# EAGLE schematic motherboard (EAGLE 6.1)
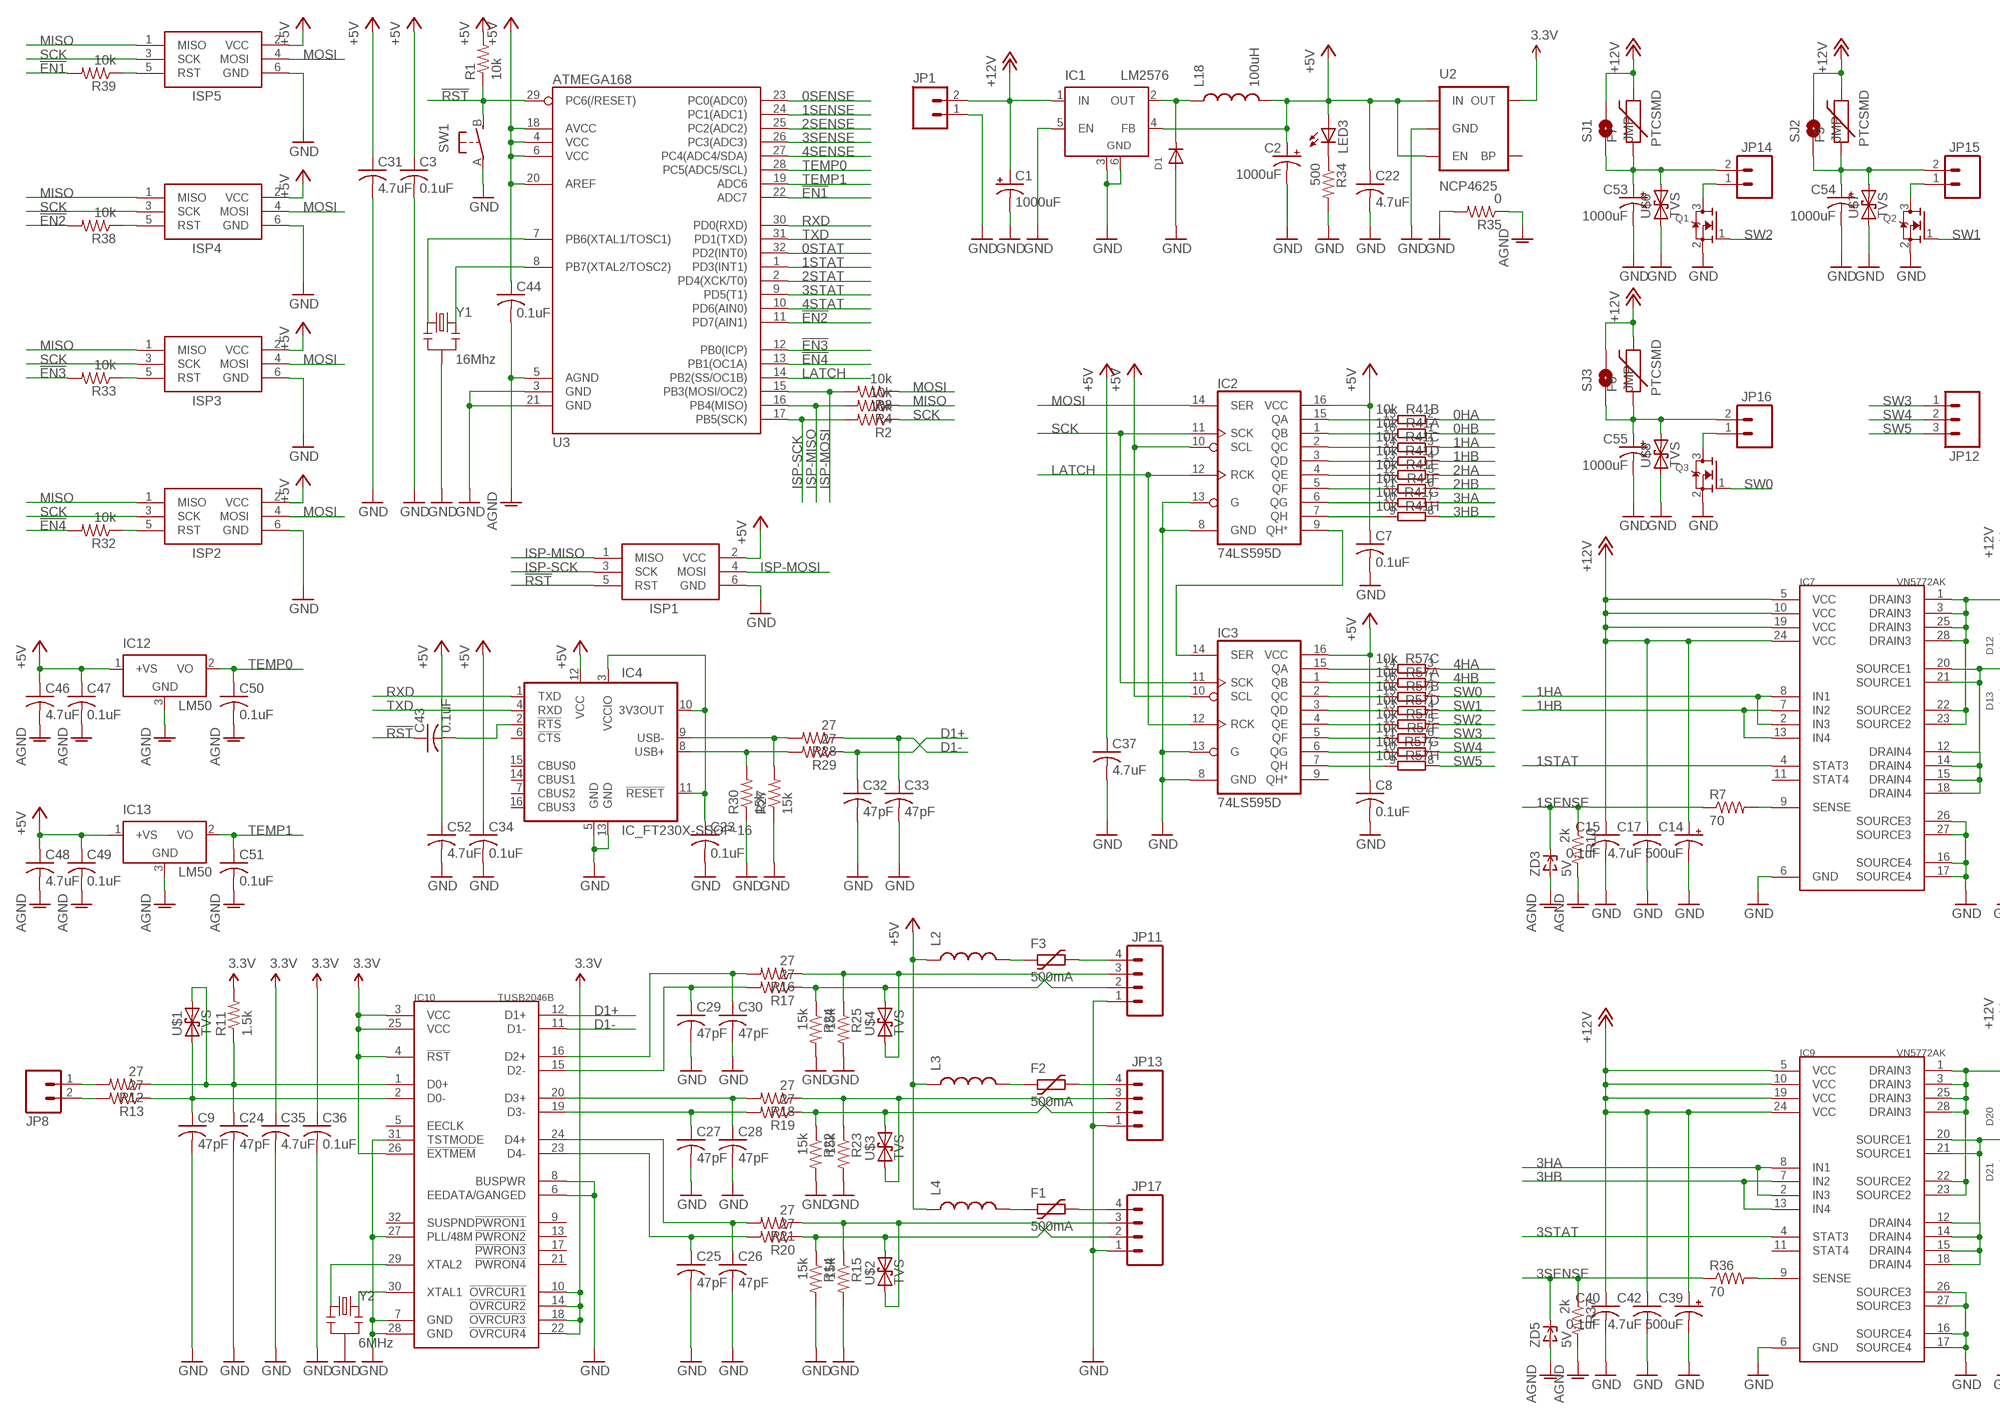
[diagram p0: schematic, sheet 1, part 1 of 2]
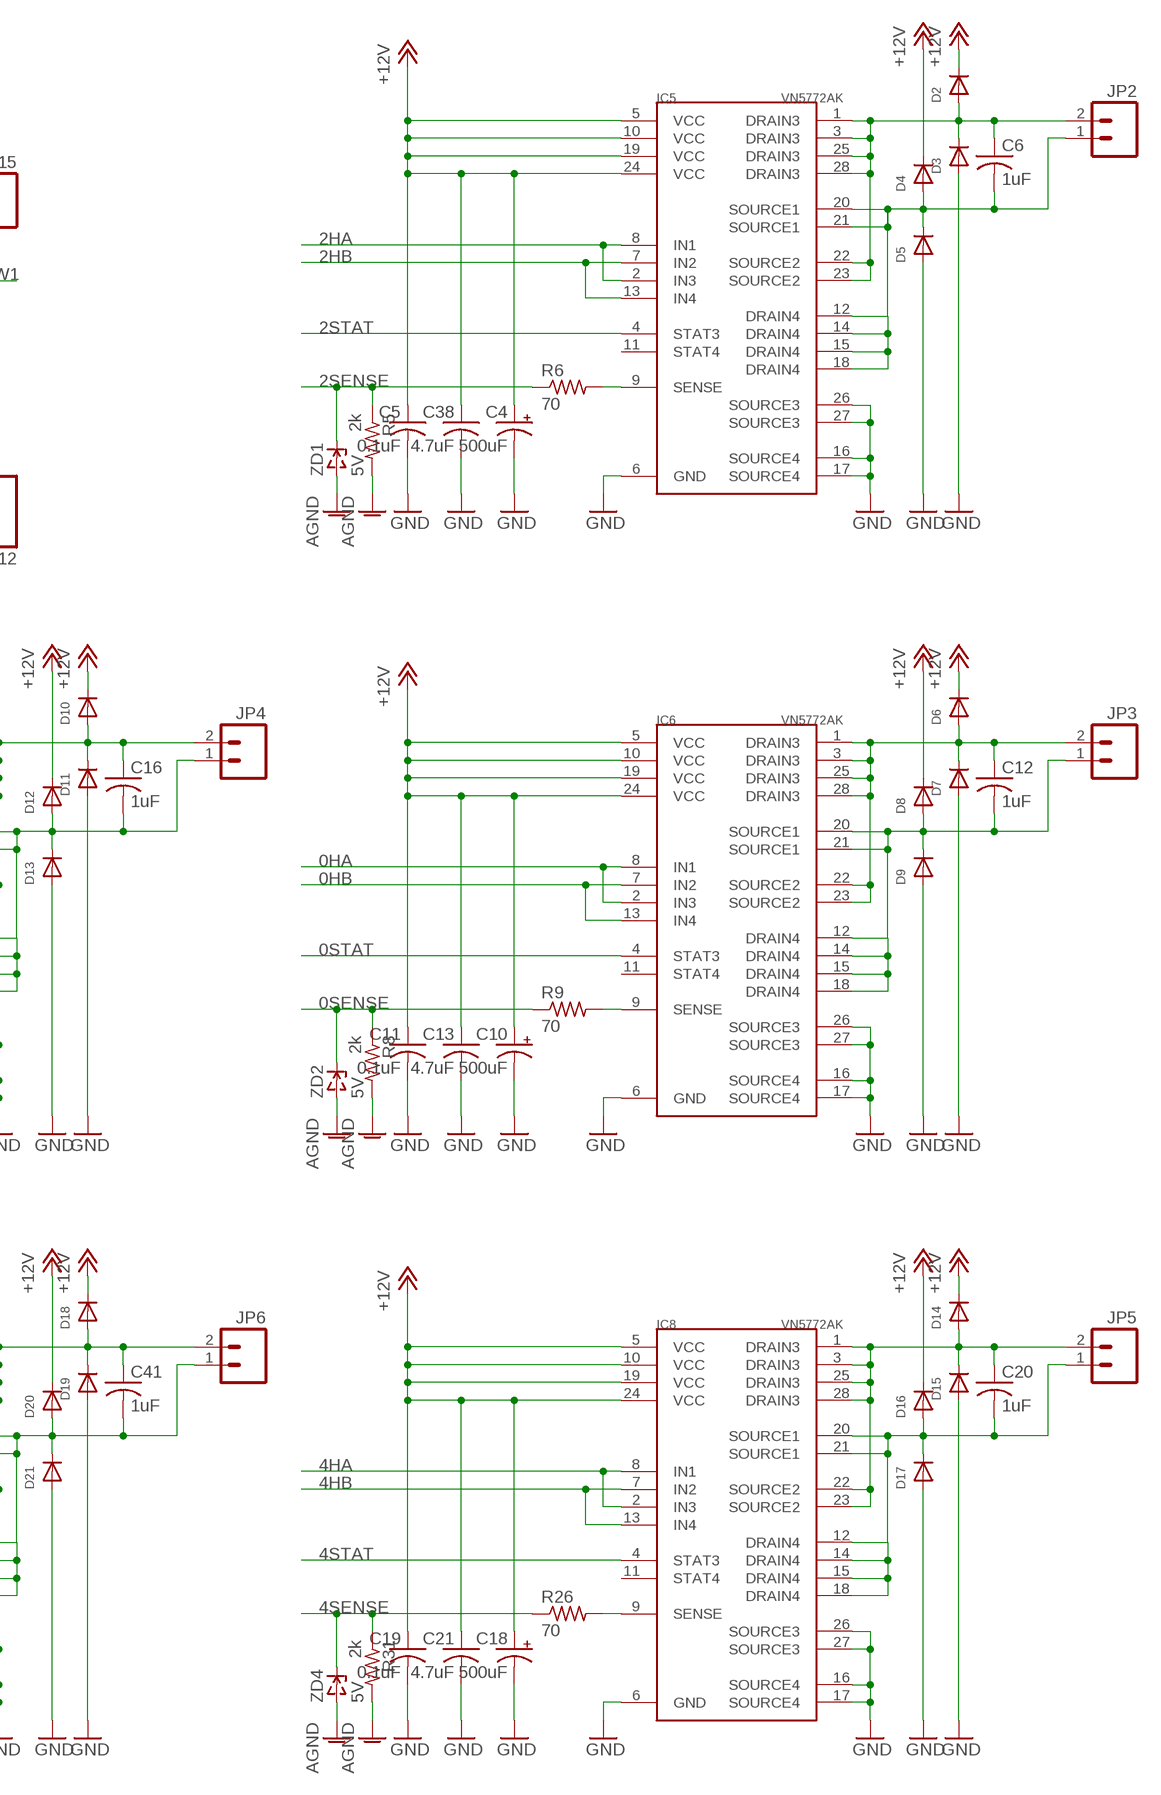
[diagram p1: schematic, sheet 1, part 2 of 2]

## Parts
C1  1000uF  CPOL-US153CLV-0807  [153CLV-0807]
C2  1000uF  CPOL-US153CLV-0807  [153CLV-0807]
C3  0.1uF  C-USC1206  [C1206]
C4  500uF  CPOL-US153CLV-0807  [153CLV-0807]
C5  0.1uF  C-USC1206  [C1206]
C6  1uF  C-USC1206  [C1206]
C7  0.1uF  C-USC1206  [C1206]
C8  0.1uF  C-USC1206  [C1206]
C9  47pF  C-USC1206  [C1206]
C10  500uF  CPOL-US153CLV-0807  [153CLV-0807]
C11  0.1uF  C-USC1206  [C1206]
C12  1uF  C-USC1206  [C1206]
C13  4.7uF  C-USC1206  [C1206]
C14  500uF  CPOL-US153CLV-0807  [153CLV-0807]
C15  0.1uF  C-USC1206  [C1206]
C16  1uF  C-USC1206  [C1206]
C17  4.7uF  C-USC1206  [C1206]
C18  500uF  CPOL-US153CLV-0807  [153CLV-0807]
C19  0.1uF  C-USC1206  [C1206]
C20  1uF  C-USC1206  [C1206]
C21  4.7uF  C-USC1206  [C1206]
C22  4.7uF  C-USC1206  [C1206]
C23  0.1uF  C-USC1206  [C1206]
C24  47pF  C-USC1206  [C1206]
C25  47pF  C-USC1206  [C1206]
C26  47pF  C-USC1206  [C1206]
C27  47pF  C-USC1206  [C1206]
C28  47pF  C-USC1206  [C1206]
C29  47pF  C-USC1206  [C1206]
C30  47pF  C-USC1206  [C1206]
C31  4.7uF  C-USC1206  [C1206]
C32  47pF  C-USC1206  [C1206]
C33  47pF  C-USC1206  [C1206]
C34  0.1uF  C-USC1206  [C1206]
C35  4.7uF  C-USC1206  [C1206]
C36  0.1uF  C-USC1206  [C1206]
C37  4.7uF  C-USC1206  [C1206]
C38  4.7uF  C-USC1206  [C1206]
C39  500uF  CPOL-US153CLV-0807  [153CLV-0807]
C40  0.1uF  C-USC1206  [C1206]
C41  1uF  C-USC1206  [C1206]
C42  4.7uF  C-USC1206  [C1206]
C43  0.1uF  C-USC1206  [C1206]
C44  0.1uF  C-USC1206  [C1206]
C46  4.7uF  C-USC1206  [C1206]
C47  0.1uF  C-USC1206  [C1206]
C48  4.7uF  C-USC1206  [C1206]
C49  0.1uF  C-USC1206  [C1206]
C50  0.1uF  C-USC1206  [C1206]
C51  0.1uF  C-USC1206  [C1206]
C52  4.7uF  C-USC1206  [C1206]
C53  1000uF  CPOL-US153CLV-0807  [153CLV-0807]
C54  1000uF  CPOL-US153CLV-0807  [153CLV-0807]
C55  1000uF  CPOL-US153CLV-0807  [153CLV-0807]
D1  DIODESMA  [SMADIODE]
D2  DIODESOD-123  [SOD-123]
D3  DIODESOD-123  [SOD-123]
D4  DIODESOD-123  [SOD-123]
D5  DIODESOD-123  [SOD-123]
D6  DIODESOD-123  [SOD-123]
D7  DIODESOD-123  [SOD-123]
D8  DIODESOD-123  [SOD-123]
D9  DIODESOD-123  [SOD-123]
D10  DIODESOD-123  [SOD-123]
D11  DIODESOD-123  [SOD-123]
D12  DIODESOD-123  [SOD-123]
D13  DIODESOD-123  [SOD-123]
D14  DIODESOD-123  [SOD-123]
D15  DIODESOD-123  [SOD-123]
D16  DIODESOD-123  [SOD-123]
D17  DIODESOD-123  [SOD-123]
D18  DIODESOD-123  [SOD-123]
D19  DIODESOD-123  [SOD-123]
D20  DIODESOD-123  [SOD-123]
D21  DIODESOD-123  [SOD-123]
F1  500mA  FUSE_PTC-1812  [PTC1812L]
F2  500mA  FUSE_PTC-1812  [PTC1812L]
F3  500mA  FUSE_PTC-1812  [PTC1812L]
F5  PTCSMD  [PTC-1206]
F6  PTCSMD  [PTC-1206]
F7  PTCSMD  [PTC-1206]
IC1  LM2576  LM2596S  [TO263-5]
IC2  74LS595D  [SO16]
IC3  74LS595D  [SO16]
IC4  IC_FT230X-SSOP-16  [SSOP-16-FTDI]
IC5  VN5772AK  [SO-28]
IC6  VN5772AK  [SO-28]
IC7  VN5772AK  [SO-28]
IC8  VN5772AK  [SO-28]
IC9  VN5772AK  [SO-28]
IC10  TUSB2046B  [LQFP-32]
IC12  LM50  [SOT23]
IC13  LM50  [SOT23]
ISP1  AVRISP-6  [AVRISP]
ISP2  AVRISP-6  [AVRISP]
ISP3  AVRISP-6  [AVRISP]
ISP4  AVRISP-6  [AVRISP]
ISP5  AVRISP-6  [AVRISP]
JP1  M023.5MM  [SCREWTERMINAL-3.5MM-2]
JP2  M023.5MM  [SCREWTERMINAL-3.5MM-2]
JP3  M023.5MM  [SCREWTERMINAL-3.5MM-2]
JP4  M023.5MM  [SCREWTERMINAL-3.5MM-2]
JP5  M023.5MM  [SCREWTERMINAL-3.5MM-2]
JP6  M023.5MM  [SCREWTERMINAL-3.5MM-2]
JP8  M023.5MM  [SCREWTERMINAL-3.5MM-2]
JP11  M04SCREW  [SCREWTERMINAL-3.5MM-4]
JP12  M03PTH  [1X03]
JP13  M04SCREW  [SCREWTERMINAL-3.5MM-4]
JP14  M023.5MM  [SCREWTERMINAL-3.5MM-2]
JP15  M023.5MM  [SCREWTERMINAL-3.5MM-2]
JP16  M023.5MM  [SCREWTERMINAL-3.5MM-2]
JP17  M04SCREW  [SCREWTERMINAL-3.5MM-4]
L2  INDUCTOR1206H*  [INDUCTOR-1206]
L3  INDUCTOR1206H*  [INDUCTOR-1206]
L4  INDUCTOR1206H*  [INDUCTOR-1206]
L18  100uH  INDUCTORPWR  [CDRH125]
LED3  LEDCHIPLED_1206  [CHIPLED_1206]
Q1  MOSFET-NREFLOW  [SOT23]
Q2  MOSFET-NREFLOW  [SOT23]
Q3  MOSFET-NREFLOW  [SOT23]
R1  10k  R-US_R1206  [R1206]
R2  10k  R-US_R1206  [R1206]
R3  10k  R-US_R1206  [R1206]
R4  10k  R-US_R1206  [R1206]
R5  2k  R-US_R1206  [R1206]
R6  70  R-US_R1206  [R1206]
R7  70  R-US_R1206  [R1206]
R8  2k  R-US_R1206  [R1206]
R9  70  R-US_R1206  [R1206]
R10  2k  R-US_R1206  [R1206]
R11  1.5k  R-US_R1206  [R1206]
R12  27  R-US_R1206  [R1206]
R13  27  R-US_R1206  [R1206]
R14  15k  R-US_R1206  [R1206]
R15  15k  R-US_R1206  [R1206]
R16  27  R-US_R1206  [R1206]
R17  27  R-US_R1206  [R1206]
R18  27  R-US_R1206  [R1206]
R19  27  R-US_R1206  [R1206]
R20  27  R-US_R1206  [R1206]
R21  27  R-US_R1206  [R1206]
R22  15k  R-US_R1206  [R1206]
R23  15k  R-US_R1206  [R1206]
R24  15k  R-US_R1206  [R1206]
R25  15k  R-US_R1206  [R1206]
R26  70  R-US_R1206  [R1206]
R27  15k  R-US_R1206  [R1206]
R28  27  R-US_R1206  [R1206]
R29  27  R-US_R1206  [R1206]
R30  15k  R-US_R1206  [R1206]
R31  2k  R-US_R1206  [R1206]
R32  10k  R-US_R1206  [R1206]
R33  10k  R-US_R1206  [R1206]
R34  500  R-US_R1206  [R1206]
R35  0  R-US_R1206  [R1206]
R36  70  R-US_R1206  [R1206]
R37  2k  R-US_R1206  [R1206]
R38  10k  R-US_R1206  [R1206]
R39  10k  R-US_R1206  [R1206]
R41  10k  2NBS16-8E  [SO16]
R57  10k  2NBS16-8E  [SO16]
SJ1  JMP  SOLDERJUMPER-OLDNO  [SJ_2S-NO]
SJ2  JMP  SOLDERJUMPER-OLDNO  [SJ_2S-NO]
SJ3  JMP  SOLDERJUMPER-OLDNO  [SJ_2S-NO]
SW1  FSMSM  [FSMSM]
U2  NCP4625  V_REG_LDOSMD  [SOT23-5]
U3  ATMEGA168  [TQFP32-08]
U$1  TVS  [SMA-DIODE]
U$2  TVS  [SMA-DIODE]
U$3  TVS  [SMA-DIODE]
U$4  TVS  [SMA-DIODE]
U$6  TVS  [SMA-DIODE]
U$7  TVS  [SMA-DIODE]
U$8  TVS  [SMA-DIODE]
Y1  16Mhz  RESONATORSMD  [RESONATOR-SMD]
Y2  6MHz  RESONATORSMD  [RESONATOR-SMD]
ZD1  5V  ZENERSOD-123  [SOD-123]
ZD2  5V  ZENERSOD-123  [SOD-123]
ZD3  5V  ZENERSOD-123  [SOD-123]
ZD4  5V  ZENERSOD-123  [SOD-123]
ZD5  5V  ZENERSOD-123  [SOD-123]

## Nets
0HA: IC6.2(IN3) IC6.8(IN1) R41.2
0HB: IC6.7(IN2) IC6.13(IN4) R41.1
0SENSE: R8.1 R9.1 U3.23(PC0(ADC0)) ZD2.C
0STAT: IC6.4(STAT3) U3.32(PD2(INT0))
1HA: IC7.2(IN3) IC7.8(IN1) R41.3
1HB: IC7.7(IN2) IC7.13(IN4) R41.4
1SENSE: R7.1 R10.1 U3.24(PC1(ADC1)) ZD3.C
1STAT: IC7.4(STAT3) U3.1(PD3(INT1))
2HA: IC5.2(IN3) IC5.8(IN1) R41.5
2HB: IC5.7(IN2) IC5.13(IN4) R41.6
2SENSE: R5.1 R6.1 U3.25(PC2(ADC2)) ZD1.C
2STAT: IC5.4(STAT3) U3.2(PD4(XCK/T0))
3.3V: C35.1 C36.1 IC10.3(VCC) IC10.4(!RST) IC10.10(!OVRCUR1) IC10.14(!OVRCUR2) IC10.18(!OVRCUR3) IC10.22(!OVRCUR4) IC10.25(VCC) IC10.26(!EXTMEM) R11.2 U2.5(OUT)
3HA: IC9.2(IN3) IC9.8(IN1) R41.7
3HB: IC9.7(IN2) IC9.13(IN4) R41.8
3SENSE: R36.1 R37.1 U3.26(PC3(ADC3)) ZD5.C
3STAT: IC9.4(STAT3) U3.9(PD5(T1))
4HA: IC8.2(IN3) IC8.8(IN1) R57.3
4HB: IC8.7(IN2) IC8.13(IN4) R57.1
4SENSE: R26.1 R31.1 U3.27(PC4(ADC4/SDA)) ZD4.C
4STAT: IC8.4(STAT3) U3.10(PD6(AIN0))
!EN1: R39.2 U3.22(ADC7)
!EN2: R38.2 U3.11(PD7(AIN1))
!EN3: R33.2 U3.12(PB0(ICP))
!EN4: R32.2 U3.13(PB1(OC1A))
!RST: C43.1 ISP1.5(RST) R1.1 SW1.B(S) U3.29(PC6(/RESET))
+5V: C2.+ C3.1 C7.1 C8.1 C22.1 C31.1 C34.1 C37.1 C44.1 C46.1 C47.1 C48.1 C49.1 C52.1 IC1.4(FB) IC2.10(SCL) IC2.16(VCC) IC3.10(SCL) IC3.16(VCC) IC4.12(VCC) IC12.1(+VS) IC13.1(+VS) ISP1.2(VCC) ISP2.2(VCC) ISP3.2(VCC) ISP4.2(VCC) ISP5.2(VCC) L2.P$1 L3.P$1 L4.P$1 L18.2 LED3.A R1.2 U2.1(IN) U2.3(EN) U3.4(VCC) U3.6(VCC) U3.18(AVCC) U3.20(AREF)
+12V: C1.+ C4.+ C5.1 C10.+ C11.1 C13.1 C14.+ C15.1 C17.1 C18.+ C19.1 C21.1 C38.1 C39.+ C40.1 C42.1 D2.C D4.C D6.C D8.C D10.C D12.C D14.C D16.C D18.C D20.C F5.2 F6.2 F7.2 IC1.1(IN) IC5.5(VCC) IC5.10(VCC) IC5.19(VCC) IC5.24(VCC) IC6.5(VCC) IC6.10(VCC) IC6.19(VCC) IC6.24(VCC) IC7.5(VCC) IC7.10(VCC) IC7.19(VCC) IC7.24(VCC) IC8.5(VCC) IC8.10(VCC) IC8.19(VCC) IC8.24(VCC) IC9.5(VCC) IC9.10(VCC) IC9.19(VCC) IC9.24(VCC) JP1.2 SJ1.2 SJ2.2 SJ3.2
AGND: C44.2 C46.2 C47.2 C48.2 C49.2 C50.2 C51.2 IC12.3(GND) IC13.3(GND) R5.2 R8.2 R10.2 R31.2 R35.1 R37.2 U3.5(AGND) ZD1.A ZD2.A ZD3.A ZD4.A ZD5.A
D1+: C32.1 IC10.12(D1+) R29.1
D1-: C33.1 IC10.11(D1-) R28.1
GND: C1.- C2.- C3.2 C4.- C5.2 C7.2 C8.2 C9.2 C10.- C11.2 C13.2 C14.- C15.2 C17.2 C18.- C19.2 C21.2 C22.2 C23.2 C24.2 C25.2 C26.2 C27.2 C28.2 C29.2 C30.2 C31.2 C32.2 C33.2 C34.2 C35.2 C36.2 C37.2 C38.2 C39.- C40.2 C42.2 C52.2 C53.- C54.- C55.- D1.A D3.A D5.A D7.A D9.A D11.A D13.A D15.A D17.A D19.A D21.A IC1.3(GND) IC1.5(EN) IC1.6(GND) IC2.8(GND) IC2.13(G) IC3.8(GND) IC3.13(G) IC4.5(GND) IC4.13(GND) IC5.6(GND) IC5.16(SOURCE4) IC5.17(SOURCE4) IC5.26(SOURCE3) IC5.27(SOURCE3) IC6.6(GND) IC6.16(SOURCE4) IC6.17(SOURCE4) IC6.26(SOURCE3) IC6.27(SOURCE3) IC7.6(GND) IC7.16(SOURCE4) IC7.17(SOURCE4) IC7.26(SOURCE3) IC7.27(SOURCE3) IC8.6(GND) IC8.16(SOURCE4) IC8.17(SOURCE4) IC8.26(SOURCE3) IC8.27(SOURCE3) IC9.6(GND) IC9.16(SOURCE4) IC9.17(SOURCE4) IC9.26(SOURCE3) IC9.27(SOURCE3) IC10.6(EEDATA/GANGED) IC10.7(GND) IC10.8(BUSPWR) IC10.27(PLL/48M) IC10.28(GND) IC10.31(TSTMODE) ISP1.6(GND) ISP2.6(GND) ISP3.6(GND) ISP4.6(GND) ISP5.6(GND) JP1.1 JP11.1 JP13.1 JP17.1 Q1.2(S) Q2.2(S) Q3.2(S) R14.2 R15.2 R22.2 R23.2 R24.2 R25.2 R27.1 R30.1 R34.2 R35.2 SW1.A(P) U2.2(GND) U3.3(GND) U3.21(GND) U$6.A U$7.A U$8.A Y1.2 Y2.2
ISP-MISO: ISP1.1(MISO) R4.2 U3.16(PB4(MISO))
ISP-MOSI: ISP1.4(MOSI) R3.2 U3.15(PB3(MOSI/OC2))
ISP-SCK: ISP1.3(SCK) R2.2 U3.17(PB5(SCK))
LATCH: IC2.12(RCK) IC3.12(RCK) U3.14(PB2(SS/OC1B))
MISO: ISP2.1(MISO) ISP3.1(MISO) ISP4.1(MISO) ISP5.1(MISO) R4.1
MOSI: IC2.14(SER) ISP2.4(MOSI) ISP3.4(MOSI) ISP4.4(MOSI) ISP5.4(MOSI) R3.1
N$1: D1.C IC1.2(OUT) L18.1
N$2: U3.8(PB7(XTAL2/TOSC2)) Y1.3
N$3: C12.2 D8.A D9.C IC6.12(DRAIN4) IC6.14(DRAIN4) IC6.15(DRAIN4) IC6.18(DRAIN4) IC6.20(SOURCE1) IC6.21(SOURCE1) JP3.1
N$4: U3.7(PB6(XTAL1/TOSC1)) Y1.1
N$5: C12.1 D6.A D7.C IC6.1(DRAIN3) IC6.3(DRAIN3) IC6.22(SOURCE2) IC6.23(SOURCE2) IC6.25(DRAIN3) IC6.28(DRAIN3) JP3.2
N$6: IC2.9(QH*) IC3.14(SER)
N$7: C9.1 IC10.2(D0-) R13.1 U$1.A
N$8: C16.2 D12.A D13.C IC7.12(DRAIN4) IC7.14(DRAIN4) IC7.15(DRAIN4) IC7.18(DRAIN4) IC7.20(SOURCE1) IC7.21(SOURCE1) JP4.1
N$9: C16.1 D10.A D11.C IC7.1(DRAIN3) IC7.3(DRAIN3) IC7.22(SOURCE2) IC7.23(SOURCE2) IC7.25(DRAIN3) IC7.28(DRAIN3) JP4.2
N$10: C20.2 D16.A D17.C IC8.12(DRAIN4) IC8.14(DRAIN4) IC8.15(DRAIN4) IC8.18(DRAIN4) IC8.20(SOURCE1) IC8.21(SOURCE1) JP5.1
N$11: C20.1 D14.A D15.C IC8.1(DRAIN3) IC8.3(DRAIN3) IC8.22(SOURCE2) IC8.23(SOURCE2) IC8.25(DRAIN3) IC8.28(DRAIN3) JP5.2
N$12: C41.2 D20.A D21.C IC9.12(DRAIN4) IC9.14(DRAIN4) IC9.15(DRAIN4) IC9.18(DRAIN4) IC9.20(SOURCE1) IC9.21(SOURCE1) JP6.1
N$13: C6.2 D4.A D5.C IC5.12(DRAIN4) IC5.14(DRAIN4) IC5.15(DRAIN4) IC5.18(DRAIN4) IC5.20(SOURCE1) IC5.21(SOURCE1) JP2.1
N$14: C41.1 D18.A D19.C IC9.1(DRAIN3) IC9.3(DRAIN3) IC9.22(SOURCE2) IC9.23(SOURCE2) IC9.25(DRAIN3) IC9.28(DRAIN3) JP6.2
N$15: IC3.7(QH) R57.9
N$16: C43.2 IC4.2(!RTS)
N$17: IC3.6(QG) R57.10
N$18: IC3.5(QF) R57.11
N$19: C24.1 IC10.1(D0+) R11.1 R12.1 U$1.C
N$21: JP17.2 R15.1 R21.1 U$2.A
N$22: IC10.30(XTAL1) Y2.3
N$23: IC10.29(XTAL2) Y2.1
N$24: JP17.3 R14.1 R20.1 U$2.C
N$25: JP13.3 R19.1 R22.1 U$3.C
N$26: C30.1 IC10.16(D2+) R16.2
N$27: C29.1 IC10.15(D2-) R17.2
N$28: C28.1 IC10.20(D3+) R18.2
N$29: C27.1 IC10.19(D3-) R19.2
N$30: C25.1 IC10.23(D4-) R20.2
N$31: C26.1 IC10.24(D4+) R21.2
N$32: JP13.2 R18.1 R23.1 U$3.A
N$33: JP11.3 R17.1 R24.1 U$4.C
N$34: JP11.2 R16.1 R25.1 U$4.A
N$35: F1.2 JP17.4
N$36: F2.2 JP13.4
N$37: F3.2 JP11.4
N$38: C23.1 IC4.3(VCCIO) IC4.10(3V3OUT) IC4.11(!RESET)
N$39: IC4.9(USB-) R27.2 R28.2
N$40: IC4.8(USB+) R29.2 R30.2
N$41: F3.1 L2.P$2
N$42: F2.1 L3.P$2
N$43: JP14.1 Q1.3(D)
N$44: JP8.1 R12.2
N$45: JP8.2 R13.2
N$46: LED3.C R34.1
N$47: JP15.1 Q2.3(D)
N$48: JP16.1 Q3.3(D)
N$49: F1.1 L4.P$2
N$50: C55.+ F6.1 JP16.2 SJ3.1 U$8.C
N$51: ISP2.5(RST) R32.1
N$52: ISP3.5(RST) R33.1
N$53: ISP4.5(RST) R38.1
N$54: C54.+ F5.1 JP15.2 SJ2.1 U$7.C
N$55: C53.+ F7.1 JP14.2 SJ1.1 U$6.C
N$56: IC3.4(QE) R57.12
N$58: ISP5.5(RST) R39.1
N$59: C6.1 D2.A D3.C IC5.1(DRAIN3) IC5.3(DRAIN3) IC5.22(SOURCE2) IC5.23(SOURCE2) IC5.25(DRAIN3) IC5.28(DRAIN3) JP2.2
N$60: IC3.3(QD) R57.13
N$61: IC3.2(QC) R57.15
N$62: IC3.1(QB) R57.16
N$63: IC3.15(QA) R57.14
N$64: IC2.7(QH) R41.9
N$65: IC2.6(QG) R41.10
N$66: IC2.5(QF) R41.11
N$67: IC2.4(QE) R41.12
N$68: IC2.3(QD) R41.13
N$69: IC2.2(QC) R41.14
N$70: IC2.1(QB) R41.16
N$71: IC2.15(QA) R41.15
N$76: IC5.9(SENSE) R6.2
N$77: IC7.9(SENSE) R7.2
N$78: IC6.9(SENSE) R9.2
N$79: IC9.9(SENSE) R36.2
N$80: IC8.9(SENSE) R26.2
RXD: IC4.1(TXD) U3.30(PD0(RXD))
SCK: IC2.11(SCK) IC3.11(SCK) ISP2.3(SCK) ISP3.3(SCK) ISP4.3(SCK) ISP5.3(SCK) R2.1
SW0: Q3.1(G) R57.2
SW1: Q2.1(G) R57.4
SW2: Q1.1(G) R57.5
SW3: JP12.1 R57.6
SW4: JP12.2 R57.7
SW5: JP12.3 R57.8
TEMP0: C50.1 IC12.2(VO) U3.28(PC5(ADC5/SCL))
TEMP1: C51.1 IC13.2(VO) U3.19(ADC6)
TXD: IC4.4(RXD) U3.31(PD1(TXD))
Unconnected: IC3.9(QH*) IC4.6(!CTS) IC4.7(CBUS2) IC4.14(CBUS1) IC4.15(CBUS0) IC4.16(CBUS3) IC5.11(STAT4) IC6.11(STAT4) IC7.11(STAT4) IC8.11(STAT4) IC9.11(STAT4) IC10.5(EECLK) IC10.9(!PWRON1) IC10.13(!PWRON2) IC10.17(!PWRON3) IC10.21(!PWRON4) IC10.32(SUSPND) U2.4(BP)

## Library data of the parts
C1 C2 C4 C10 C14 C18 C39 C53-C55 = adafruit:CPOL-US: POLARIZED CAPACITOR, American symbol
C3 C5-C9 C11-C13 C15-C17 C19-C38 C40-C44 C46-C52 = adafruit:C-US: CAPACITOR, American symbol
D1-D21 = adafruit:DIODE: Diode SMADIODE - SMA Surface Mount Package 20V 1A Schottky Diode Digikey: 641-1014-6-ND DO-1N4148 - Through Hole Small Current Diode SOD-123 20V 1 A (.5mV Vf) Schottky Diode - Digikey: MBRX120TPMSCT-ND SOD-323 10V 570mA (.38mV Vf, 3ns) Schottky Diode - Digikey: ZLLS410CT-ND SOD-523 30V 30mA Schottky Diode (RB751S-40TE61) - Digikey: RB751S-40TE61CT-ND SOT23-R/W - SOT23 Package (R = Solder Paste/Reflow Ovens, W = Hand-Soldering) BAT54Film 40V 300mA - Digikey: 497-7162-1-ND
F1-F3 = dp_devices:FUSE_PTC: Resettable PTC
F5-F7 = sparkfun:PTC: Resettable Fuse PTC Resettable Fuse. Spark Fun Electronics SKU : COM-08357
IC1 = linear:LM2596S: STEP-DOWN VOLTAGE REGULATOR
IC2 IC3 = sparkfun:74*595: 8-bit SHIFT REGISTER, output latch
IC4 = dp_devices:IC_FT230X: BASIC USB to UART IC
IC5-IC9 = rov_club:VN5772AK: VN5772AK H-Bridge
IC10 = rov_club:TUSB2046B: TUSB2046B 4-port USB controller
IC12 IC13 = linear:LM50: SOT-23 Single-Supply Centigrade Temperature Sensor Vout = (10mV/°C x Temp °C) +5mmmV Source: http://cache.national.com/ds/LM/LM50.pdf
ISP1-ISP5 = adafruit:AVRISP: AVR ISP HEADER Standard 6 pin header for AVR programming
JP1-JP6 JP8 JP14-JP16 = sparkfun:M02: Header 2 Standard 2-pin 0.1" header. Use with straight break away headers (SKU : PRT-00116), right angle break away headers (PRT-00553), swiss pins (PRT-00743), machine pins (PRT-00117), and female headers (PRT-00115). Molex polarized connector foot print use with SKU : PRT-08233 with associated crimp pins and housings.
JP11 JP13 JP17 = sparkfun:M04: Header 4 Standard 4-pin 0.1" header. Use with straight break away headers (SKU : PRT-00116), right angle break away headers (PRT-00553), swiss pins (PRT-00743), machine pins (PRT-00117), and female headers (PRT-00115). Molex polarized connector foot print use with SKU : PRT-08231 with associated crimp pins and housings. 1MM SMD Version SKU: PRT-10208
JP12 = sparkfun:M03: Header 3 Standard 3-pin 0.1" header. Use with straight break away headers (SKU : PRT-00116), right angle break away headers (PRT-00553), swiss pins (PRT-00743), machine pins (PRT-00117), and female headers (PRT-00115). Molex polarized connector foot print use with SKU : PRT-08232 with associated crimp pins and housings.
L2-L4 L18 = sparkfun:INDUCTOR: Inductors Basic Inductor/Choke - 0603 and 1206. Footprints are not proven and vary greatly between part numbers.
LED3 = adafruit:LED: LED OSRAM: - CHIPLED LG R971, LG N971, LY N971, LG Q971, LY Q971, LO R971, LY R971 LH N974, LH R974 LS Q976, LO Q976, LY Q976 LO Q996 - Hyper CHIPLED LW Q18S LB Q993, LB Q99A, LB R99A - SideLED LS A670, LO A670, LY A670, LG A670, LP A670 LB A673, LV A673, LT A673, LW A673 LH A674 LY A675 LS A676, LA A676, LO A676, LY A676, LW A676 LS A679, LY A679, LG A679 - Hyper Micro SIDELED® LS Y876, LA Y876, LO Y876, LY Y876 LT Y87S - SmartLED LW L88C, LW L88S LB L89C, LB L89S, LG L890 LS L89K, LO L89K, LY L89K LS L896, LA L896, LO L896, LY L896 - TOPLED LS T670, LO T670, LY T670, LG T670, LP T670 LSG T670, LSP T670, LSY T670, LOP T670, LYG T670 LG T671, LOG T671, LSG T671 LB T673, LV T673, LT T673, LW T673 LH T674 LS T676, LA T676, LO T676, LY T676, LB T676, LH T676, LSB T676, LW T676 LB T67C, LV T67C, LT T67C, LS T67K, LO T67K, LY T67K, LW E67C LS E67B, LA E67B, LO E67B, LY E67B, LB E67C, LV E67C, LT E67C LW T67C LS T679, LY T679, LG T679 LS T770, LO T770, LY T770, LG T770, LP T770 LB T773, LV T773, LT T773, LW T773 LH T774 LS E675, LA E675, LY E675, LS T675 LS T776, LA T776, LO T776, LY T776, LB T776 LHGB T686 LT T68C, LB T68C - Hyper Mini TOPLED® LB M676 - Mini TOPLED Santana® LG M470 LS M47K, LO M47K, LY M47K Source: http://www.osram.convergy.de/
Q1-Q3 = adafruit:MOSFET-N: N-Channel Mosfet 2N7002E - 60V 260mA SOT23 [Digikey: 2N7002ET1GOSTR-ND] - REEL BSH103 - 30V 850mA SOT23 [Digikey: 568-5013-1-ND]
R1-R39 = adafruit:R-US_: RESISTOR, American symbol
R41 R57 = resistor-bourns:2NBS16-8E: BOURNS RESISTOR NETWORK; OC_FARNELL: unknown; OC_NEWARK: unknown
SJ1-SJ3 = sparkfun:SOLDERJUMPER-OLD: Solder Jumper Standard SMD solder jumper. Used to automate production. Two varients : Normally Open and Normally Closed are the same, but have different paste layers. NC will have a large amount of paste and should jumper during reflow.
SW1 = alcoswitch:FSMSM: SPST momentary tactile switch 2 pin
U2 = sparkfun:V_REG_LDO: Voltage Regulator LDO Standard 150mA LDO voltage regulator in SOT-23 layout. Micrel part MIC5205. BP (by-pass) pin is used to lower output noise with 470pF cap.
U3 = sparkfun:ATMEGA168
U$1-U$4 U$6-U$8 = sparkfun:TVS
Y1 Y2 = sparkfun:RESONATOR: Resonator Small SMD resonator. This is the itty bitty 10/20MHz resonators with built in caps. CSTCE10M0G55 and CSTCE20M0V53. Footprint has been reviewed closely but hasn't been tested yet.
ZD1-ZD5 = dp_devices:ZENER: Zener Diode SOD-323